# Altium project Analog.PrjPcb
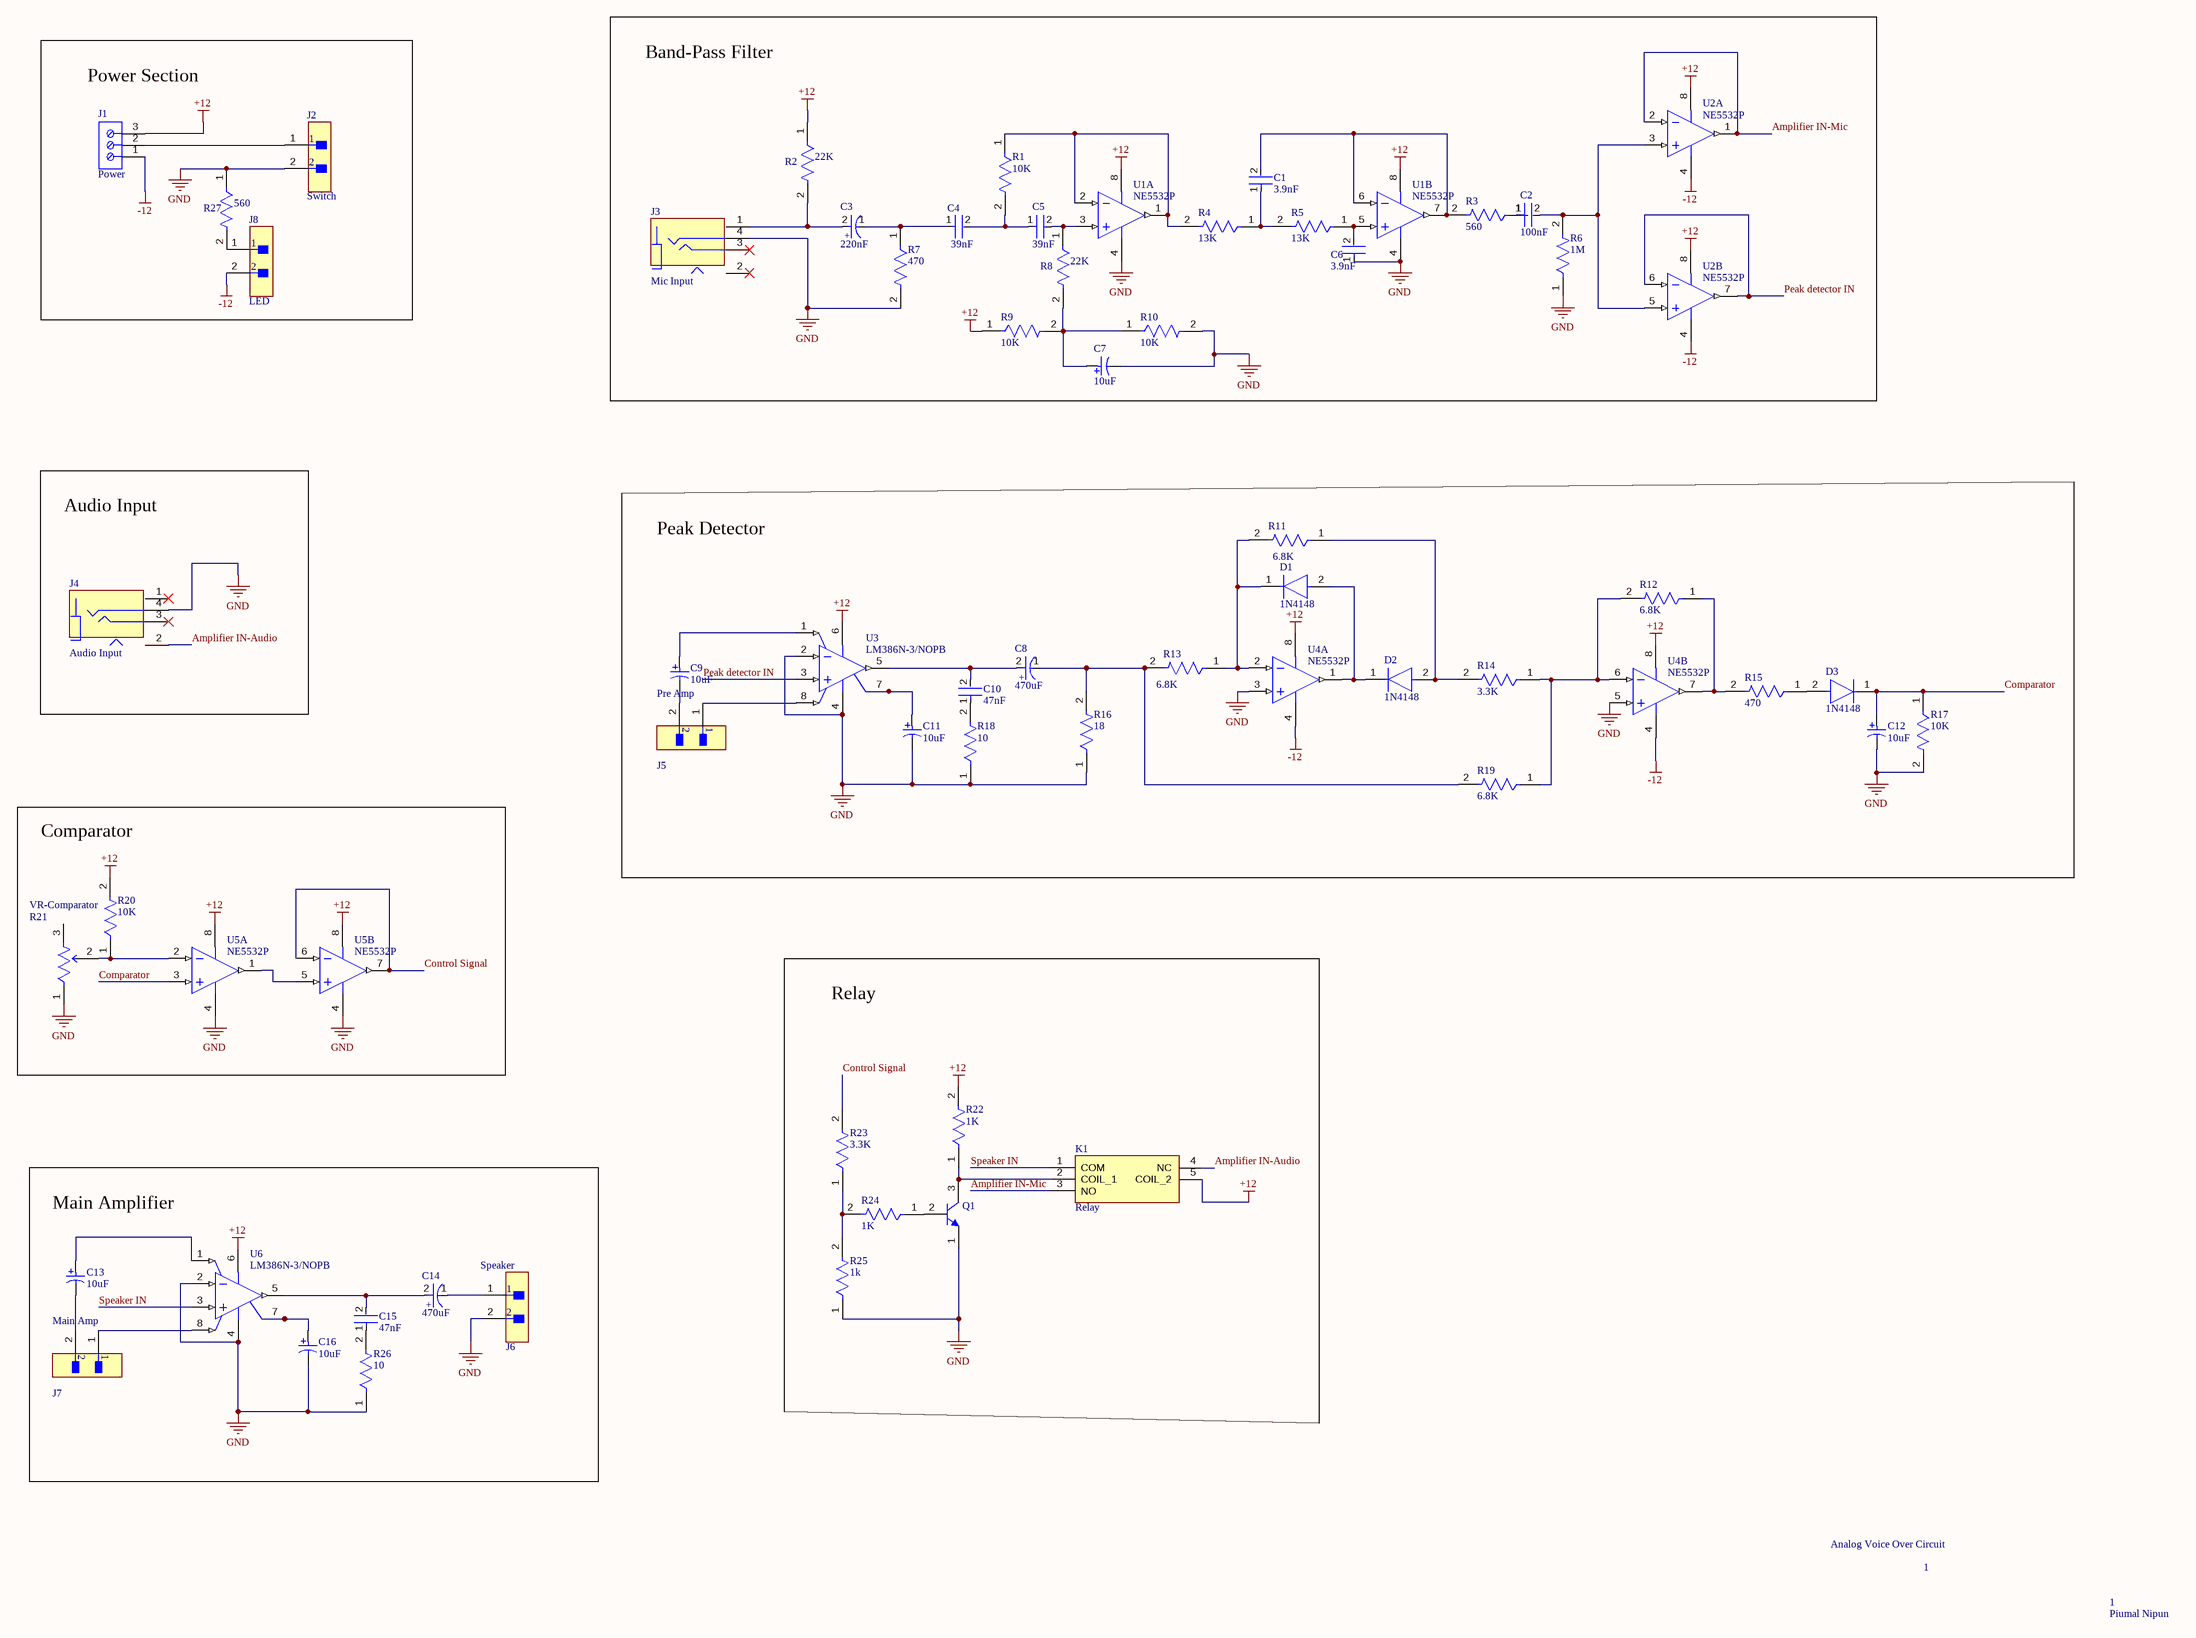
[diagram p0: Analog.SchDoc]
1 sheet, 62 parts. Net scope: global (net labels, ports and power ports of the same name join across sheets).
Board file: Analog.PcbDoc

## Sheet Analog.SchDoc
size C; ENG_APP_DATE: --/--/--; DSN_APP_DATE: --/--/--; CHK_APP_DATE: --/--/--; SheetNumber: 1; SheetTotal: 1

### Parts
C1  3.9nF  [FP-RCE0DB-MFG]
C2  100nF  [FP-RCE0DB-MFG]
C3  220nF  [FP-RAD-TH-D_8_0_5-L_11_5-MFG]
C4  39nF  [FP-RCE0DB-MFG]
C5  39nF  [FP-RCE0DB-MFG]
C6  3.9nF  [FP-RCE0DB-MFG]
C7  10uF  [CAPPR55-200-1100X500X1200]
C8  470uF  [FP-RAD-TH-D_8_0_5-L_11_5-MFG]
C9  10uF  [CAPPR55-200-1100X500X1200]
C10  47nF  [FP-RCE0DB-MFG]
C11  10uF  [CAPPR55-200-1100X500X1200]
C12  10uF  [CAPPR55-200-1100X500X1200]
C13  10uF  [CAPPR55-200-1100X500X1200]
C14  470uF  [FP-RAD-TH-D_8_0_5-L_11_5-MFG]
C15  47nF  [FP-RCE0DB-MFG]
C16  10uF  [CAPPR55-200-1100X500X1200]
D1  1N4148  [FP-017AG-MFG]
D2  1N4148  [FP-017AG-MFG]
D3  1N4148  [FP-017AG-MFG]
J1  Power  [691101710003]
J2  Switch  [FP-B2B-XH-A_LF_SN-MFG]
J3  Mic Input  [CUI_SJ2-3574A-SMT-TR]
J4  Audio Input  [CUI_SJ2-3574A-SMT-TR]
J5  Pre Amp  [FP-B2B-XH-A_LF_SN-MFG]
J6  Speaker  [FP-B2B-XH-A_LF_SN-MFG]
J7  Main Amp  [FP-B2B-XH-A_LF_SN-MFG]
J8  LED  [FP-B2B-XH-A_LF_SN-MFG]
K1  Relay  [AZ9431CH12DE]
Q1  (no value)  [FAIR-TO-92]
R1  10K  [FP-CF18-MFG]
R2  22K  [FP-CF18-MFG]
R3  560  [FP-CF18-MFG]
R4  13K  [FP-CF18-MFG]
R5  13K  [FP-CF18-MFG]
R6  1M  [FP-CF18-MFG]
R7  470  [FP-CF18-MFG]
R8  22K  [FP-CF18-MFG]
R9  10K  [FP-CF18-MFG]
R10  10K  [FP-CF18-MFG]
R11  6.8K  [FP-CF18-MFG]
R12  6.8K  [FP-CF18-MFG]
R13  6.8K  [FP-CF18-MFG]
R14  3.3K  [FP-CF18-MFG]
R15  470  [FP-CF18-MFG]
R16  18  [FP-CF18-MFG]
R17  10K  [FP-CF18-MFG]
R18  10  [FP-CF18-MFG]
R19  6.8K  [FP-CF18-MFG]
R20  10K  [FP-CF18-MFG]
R21  VR-Comparator  [FP-3296W-MFG]
R22  1K  [FP-CF18-MFG]
R23  3.3K  [FP-CF18-MFG]
R24  1K  [FP-CF18-MFG]
R25  1k  [FP-CF18-MFG]
R26  10  [FP-CF18-MFG]
R27  560  [FP-CF18-MFG]
U1  NE5532P  [P0008A]  (parts A,B of 2)
U2  NE5532P  [P0008A]  (parts A,B of 2)
U3  LM386N-3/NOPB  [TI-P8]
U4  NE5532P  [P0008A]  (parts A,B of 2)
U5  NE5532P  [P0008A]  (parts A,B of 2)
U6  LM386N-3/NOPB  [TI-P8]

### Blocks framed on the sheet
Power Section: J1 J2 J8 R27
Band-Pass Filter: C1-C7 J3 R1-R10 U1 U2
Audio Input: J4
Peak Detector: C8-C12 D1-D3 J5 R11-R19 U3 U4
Comparator: R20 R21 U5
Relay: K1 Q1 R22-R25
Main Amplifier: C13-C16 J6 J7 R26 U6

### Nets
+12: J1.3 K1.5(COIL_2) R2.1 R9.1 R20.2 R22.2 U1.8(VCC+) U2.8(VCC+) U3.6(VS) U4.8(VCC+) U5.8(VCC+) U6.6(VS)
-12: J1.1 J8.2 U2.4(VCC-) U4.4(VCC-)
GND: C6.1 C7.2 C11.2 C12.2 C16.2 J2.2 J3.4 J4.4 J6.2 Q1.1(E) R6.1 R7.2 R10.2 R16.1 R17.2 R18.1 R21.1(CCW) R25.1 R26.1 R27.1 U1.4(VCC-) U3.2(IN-) U3.4(GND) U4.3(IN1+) U4.5(IN2+) U5.4(VCC-) U6.2(IN-) U6.4(GND)
Amplifier IN-Audio: J4.2 K1.4(NC)
Amplifier IN-Mic: K1.3(NO) U2.1(OUT1) U2.2(IN1-)
Comparator: C12.1 D3.1(C) R17.1 U5.3(IN1+)
Control Signal: R23.2 U5.6(IN2-) U5.7(OUT2)
Peak detector IN: U2.6(IN2-) U2.7(OUT2) U3.3(IN+)
Speaker IN: K1.1(COM) U6.3(IN+)
NetC1_1: C1.1 R4.1 R5.2
NetC1_2: C1.2 R3.2 U1.6(IN2-) U1.7(OUT2)
NetC2_1: C2.1 R3.1
NetC2_2: C2.2 R6.2 U2.3(IN1+) U2.5(IN2+)
NetC3_1: C3.1(C) C4.1 R7.1
NetC3_2: C3.2(A) J3.1 R2.2
NetC4_2: C4.2 C5.1 R1.2
NetC5_2: C5.2 R8.1 U1.3(IN1+)
NetC6_2: C6.2 R5.1 U1.5(IN2+)
NetC7_1: C7.1 R8.2 R9.2 R10.1
NetC8_1: C8.1(C) R13.2 R16.2 R19.2
NetC8_2: C8.2(A) C10.2 U3.5(VOUT)
NetC9_1: C9.1 U3.1(GAIN)
NetC9_2: C9.2 J5.2
NetC10_1: C10.1 R18.2
NetC11_1: C11.1 U3.7(BYPASS)
NetC13_1: C13.1 U6.1(GAIN)
NetC13_2: C13.2 J7.2
NetC14_1: C14.1(C) J6.1
NetC14_2: C14.2(A) C15.2 U6.5(VOUT)
NetC15_1: C15.1 R26.2
NetC16_1: C16.1 U6.7(BYPASS)
NetD1_1: D1.1(C) R11.2 R13.1 U4.2(IN1-)
NetD1_2: D1.2(A) D2.1(C) U4.1(OUT1)
NetD2_2: D2.2(A) R11.1 R14.2
NetD3_2: D3.2(A) R15.1
NetJ1_2: J1.2 J2.1
NetJ5_1: J5.1 U3.8(GAIN)
NetJ7_1: J7.1 U6.8(GAIN)
NetJ8_1: J8.1 R27.2
NetK1_2: K1.2(COIL_1) Q1.3(C) R22.1
NetQ1_2: Q1.2(B) R24.1
NetR1_1: R1.1 R4.2 U1.1(OUT1) U1.2(IN1-)
NetR12_1: R12.1 R15.2 U4.7(OUT2)
NetR12_2: R12.2 R14.1 R19.1 U4.6(IN2-)
NetR20_1: R20.1 R21.2(WIPER) U5.2(IN1-)
NetR23_1: R23.1 R24.2 R25.2
NetU5_1: U5.1(OUT1) U5.5(IN2+)

Not connected (* = marked no-connect by the designer): J3 2* 3*; J4 1* 3*; R21 3(CW)

### Notes on the sheet
- Analog Voice Over Circuit
- 1
- Piumal Nipun
- DWG. NO.
- REV.
- SHT.
- REVISION
- DESCRIPTION
- DATE
- APPROVED
- THIS DOCUMENT AND THE DATA DISCLOSED HEREIN OR HEREWITH IS THE PROPERTY OF ALTIUM LIMITED AND MAY BE FREELY DISTRIBUTED IN WHOLE. NO RIGHTS ARE RESERVED OR EXPRESS OR IMPLIED WARANTEE GIVEN.
- ENG:
- DSN:
- APPROVALS
- PROJECT
- DOCUMENT REVISION:
- DESIGN ITEM:
- CHK:
- BOM:
- REFERENCE DOCUMENTS
- PROJECT REVISION:
- TITLE
- FAB DWG:
- PCB DWG:
- ASSY DWG:
- SCALE:
- SIZE
- C
- CAGE CODE
- FILE NAME
- DWG NO.
- SHEET
- OF
- REV
- (in symbol CMP-05427-001287-1) +

### Library data of the parts
C1 C2 C4-C6 C10 C15 = CMP-06035-047347-1: Cap Ceramic 22pF 100V C0G ±5% Radial 2.5mm +125°C Ammo Pack; Lead Diameter: 0.5mm; Lead/Base Style: Straight; Height: 3.5mm; Voltage: 100V; Mount: Through Hole; Min Operating Temperature: -55°C; Height - Seated (Max): 0.138inch; Dielectric: C0G; Width: 0.098inch; Depth: 2.5mm; Lead Pitch: 0.098inch; Packaging: Tape and Reel; Voltage Rating (DC): 100V; Capacitance: 22pF; Package Quantity: 2000; Max Operating Temperature: 125°C; Tolerance: 5%; Termination: Radial; Voltage Rating: 100V; Case/Package: Radial; Resistor Type: Ceramic; Length: 3.6mm; Ratings: AEC-Q200
C3 C8 C14 = CMP-05427-001287-1: Aluminum Electrolytic Capacitors (Radial Lead Type) 470uF ±20% 16V; Life (Hours): 6000Hour; Lead Diameter: 0.6mm; Ripple Current: 950mA; Impedance: 56mR; Voltage Rating: 16V; Features: General Purpose; Capacitance: 470uF; Max Operating Temperature: 105°C; RoHS Compliant: Yes; Mount: Through Hole; Termination: Radial; Voltage Rating (DC): 16V; Series: FR; Case/Package: Radial; Radiation Hardening: No; Diameter: 8mm; Lead Free: Lead Free; Height - Seated (Max): 0.512inch; Lead Pitch: 5mm; Tolerance: 20%; Height: 11.5mm; ESR (Equivalent Series Resistance): 56mR; Packaging: Ammo Pack; Length: 11.5mm; Package Quantity: 1; Min Operating Temperature: -40°C; REACH SVHC: No SVHC
C7 C9 C11-C13 C16 = CMP-1665-00038-2: Aluminum Electrolytic Capacitor, 10 uF, +/- 20%, 50 V, -40 to 85 degC, 2-Pin THD, RoHS, Bulk; Manufacturer: Panasonic; Life (Hours): 2000Hour; Lead/Base Style: Straight; Dissipation Factor: 0.12%; Leakage Current: 3uA; Dielectric Material: Aluminium; Lead Diameter: 0.5mm; Voltage Rating: 50V; Ripple Current: 65mA; Package Reference: CAPPR55-200-1100X500X1200; Height: 11mm; Diameter: 5mm; REACH SVHC: NoSVHC; Mount: ThroughHole; Packaging: Bulk; Manufacturer URL: http://www.panasonic.com/; Capacitance: 10uF; Termination: Radial; Datasheet URL: https://industrial.panasonic.com/cdbs/www-data/pdf/RDF0000/ABA0000C1218.pdf; Lead Free: LeadFree; Height - Seated (Max): 0.472inch; Case/Package: Radial; Package Description: 2-Pin Radial Lead, Dia 5 mm, Height 12 mm; Tolerance: 20%; Datasheet Version: Rev. 05, 10/2016; Package Quantity: 200; Ripple Current (AC): 65mA; Min Operating Temperature: -40degC; RoHSCompliant: true; Number of Pins: 2; Max Operating Temperature: 85degC; Voltage: 50V; Lead Pitch: 2mm; Radiation Hardening: No; Voltage Rating (DC): 50V; Length: 11mm
D1-D3 = CMP-07163-000046-1: DIODE GEN PURP 100V 200MA DO35; Forward Voltage: 1V; Max Power Dissipation: 500mW; Max Reverse Current: 5uA; Forward Current: 300mA; Current: 4A; Reverse Recovery Time: 4ns; Element Configuration: Single; Outside Diameter: 1.85mm; Capacitance: 4pF; Polarity: Standard; Max Forward Surge Current (Ifsm): 1A; Reverse Voltage: 100V; Output Current: 200mA; Average Rectified Current: 200mA; Diameter: 1.91mm; Max Repetitive Reverse Voltage (Vrrm): 100V; Current Rating: 200mA; Case/Package: DO-35; Lead Free: Lead Free; Number of Pins: 2; Recovery Time: 4ns; Packaging: Bulk; Contact Plating: Tin; Voltage: 100V; Mount: Through Hole; Max Surge Current: 4A; Package Quantity: 2000; Width: 1.91mm; Max Reverse Voltage (DC): 100V; Length: 4.56mm; Radiation Hardening: No; Power Dissipation: 500mW; Voltage Rating (DC): 100V; Peak Non-Repetitive Surge Current: 4A; REACH SVHC: No SVHC; Height: 4.56mm; Max Operating Temperature: 175°C; Series: -; Weight: 0.01lb; Min Operating Temperature: -65°C
J1 = CMP-1502-03257-2: NexarPartId: 8917705; Voltage Rating: 250V; Current: 16A; Wire Gauge (Min): 14AWG; Pitch: 5.0038mm; Wire Gauge (Max): 26AWG; Number of Positions Per Level: 3; Plating: Steel; Number of Levels: 1; Stripping Length: -7mm; REACH SVHC: Unknown; Width: 16.2mm; Height: 16.4mm; Contact Material: Brass; RoHS: Compliant; Color: Blue; Contact Plating: Tin; Lead Pitch: 5mm; Packaging: Box; Termination: Screw; Number of Contacts: 3; Wire/Cable Gauge: 26AWG; Min Operating Temperature: -40°C; Max Operating Temperature: 105°C; Housing Material: Nylon; Length: 9mm; Voltage: 250V; Mount: Through Hole; Current Rating: 16A; Number of Pins: 3
J2 J5-J8 = CMP-2000-05888-3: CONN HEADER VERT 2POS 2.5MM; Current Rating: 3A; Voltage Rating: 250V; Number of Contacts: 2; Contact Resistance: 20mR; Wire/Cable Gauge: 22AWG; Insulation Resistance: 1GR; Connector Type: Male Pin; Packaging: Bulk; Contact Material: Brass; Lead Free: Lead Free; Orientation: Straight; Contact Plating: Tin; Max Current Rating: 3A; Termination: Solder; Fastening Type: Detent; Depth: 5.75mm; Housing Material: Polyamide; REACH SVHC: No SVHC; Series: XH; Voltage Rating (AC): 250V; Number of Positions: 2; Color: Natural; Contact Type: Male Pin; Max Voltage Rating (DC): 250V; Pitch: 2.5mm; Lead Pitch: 2.5mm; Mount: Through Hole; Max Operating Temperature: 85°C; Length: 7.4mm; Max Voltage Rating (AC): 250V; Min Operating Temperature: -25°C; Number of Rows: 1; Housing Color: White
J3 J4 = SJ2-3574A-SMT-TR: 3.5 mm, Stereo, Right Angle, Surface Mount (SMT), Audio Jack Connector; MF: CUI Devices; SnapEDA_Link: https://www.snapeda.com/parts/SJ2-3574A-SMT-TR/CUI+Devices/view-part/?ref=snap; Package: None; MP: SJ2-3574A-SMT-TR; CUI_purchase_URL: https://www.cuidevices.com/product/interconnect/connectors/audio-connectors/jacks/sj2-357x-smt-series?utm_source=snapeda.com&utm_medium=referral&utm_campaign=snapedaBOM; Check_prices: https://www.snapeda.com/parts/SJ2-3574A-SMT-TR/CUI+Devices/view-part/?ref=eda; Purchase-URL: https://pricing.snapeda.com/search/part/SJ2-3574A-SMT-TR/?ref=eda; Price: None; Value: *; Availability: In Stock
K1 = AZ943-1CH-12DE: Relay or Contactor; Manufacturer_Name: Zettler Group; Datasheet Link: http://www.azettler.com/pdfs/az943.pdf; Height: 15.95mm; Manufacturer_Part_Number: AZ943-1CH-12DE
Q1 = CMP-2000-04944-1: NPN General-Purpose Amplifier, 40 V VCEO, 0.2 A, -55 to 150 degC, 2-Pin TO-92, RoHS, Bulk; Manufacturer: FairchildSemiconductor; Maximum Collector Base Voltage: 60V; Minimum DC Current Gain: 40@0.1mA@1V; Maximum Collector Emitter Voltage: 40V; Maximum DC Collector Current: 0.2A; Rad Hard: No; Maximum Operating Frequency: 300(Min)MHz; Maximum Collector Emitter Saturation Voltage: 0.2@1mA@10mA; Maximum Power Dissipation: 625mW; Package Description: 3-Pin Transistor Outline Package, Body Dia 4.79 mm, Pitch 1.27 mm; Package Reference: TO-92; Pin Count: 3; Operating Temperature: -55to150degC; Category: GPBJT; Manufacturer URL: https://www.fairchildsemi.com/; Datasheet URL: https://datasheet.ciiva.com/4722/2n3904-82270-4722369.pdf; Package: 3TO-92; Packaging: Bulk; Type: NPN; Datasheet Version: Rev. 1.1.0, 10/2014; Mounting: ThroughHole
R1-R20 R22-R27 = CMP-26528-000002-1: RES 10K OHM 1/8W 5% CF AXIAL; Manufacturer Part Number: CF18JT10K0; Manufacturer: Stackpole Electronics; Power Rating: 0.125W; Temperature Coefficient: 0-500ppm/°C; Resistance: 10kΩ; Voltage Rating: 250V; Value: 10kΩ; Temperature: -55°C to +155°C; Height: 2mm; Lead Free: Yes; Automotive: No; Device Class L2: Resistors; Package: CF18; Series: CF; ComponentLink2Description: Datasheet; Ipc Land Pattern Name: RESAD656W65L360D200; Temperature Range High: +155°C; RoHS: TRUE; Device Class L3: Through-Hole Resistors; Temperature Range Low: -55°C; Device Class L1: Passive Components; Category: Res; Octopart: https://octopart.com/cf18jt10k0-stackpole+electronics-19205642; Composition: Carbon Film; Digikey Description: RES 10K OHM 1/8W 5% CF AXIAL; ComponentLink2URL: http://www.seielect.com/Catalog/SEI-CF_CFM.pdf; Tolerance: 5%
R21 = CMP-1747-00001-8: TRIMMER 10K OHM 0.5W PC PIN TOP; Number of Turns: 25; Tolerance: 10%; Resistance: 10kR; Max Power Dissipation: 500mW; Temperature Coefficient: 100ppm/°C; Insulation Resistance: 1GR; Min Operating Temperature: -55°C; Resistor Type: Cermet; Series: 3296; Color: Blue; Mount: Through Hole; Taper: Linear; Radiation Hardening: No; RoHS Compliant: Yes; Width: 9.53mm; Resistance Tolerance: 10%; Contact Plating: Tin; Military Standard: Not; Package Quantity: 50; Weight: 0.03oz; Lead Free: Lead Free; Power Rating: 500mW; Termination: Pin; Technology: CERMET; Max Operating Temperature: 125°C; Packaging: Rail/Tube; Length: 9.53mm; Depth: 4.83mm; Height: 11.55mm; Reach SVHC Compliant: Yes
U1 U2 U4 U5 = CMP-0017-00910-2: Dual Low-Noise High-Speed Audio Operational Amplifier, 10 to 30 V, 0 to 70 degC, 8-pin DIP (P8), Pb-Free (RoHS); Manufacturer: Texas Instruments; Iq per channel(Max)(mA): 4; Slew Rate(Typ)(V/us): 9; Vn at 1kHz(Typ)(nV/rtHz): 5; IIB(Max)(pA): 800000; Total Supply Voltage(Max)(+5V is 5, +/-5V is 10): 30; GBW(Typ)(MHz): 10; CMRR(Min)(dB): 70; Number of Channels: 2; Sub Family: General Purpose Amplifier, High Supply Voltage Amplifier (>=30V), Low Noise Amp (<=10nV/rtHz); ComponentLink2URL: http://www.ti.com/lit/ds/symlink/ne5532.pdf; PackageReference: P0008A; PackageDescription: 8-Pin Plastic In-Line, Body 9.59 x 6.35 mm, Pitch 2.54 mm; ComponentLink1Description: Manufacturer URL; Eco-Plan: Pb-Free (RoHS); Mounting Technology: Through Hole; Code_JEDEC: MS-001; PackageVersion: 4040082/E, 04/2010; DatasheetVersion: SLOS075I; ComponentLink3URL: http://www.ti.com/litv/pdf/mpdi001b; ComponentLink2Description: Datasheet; Vio (25C)(Max)(mV): 4; PartNumber: NE5532P; ComponentLink3Description: Package Specification; Total Supply Voltage(Min)(+5V is 5, +/-5V is 10): 10; ComponentLink1URL: http://www.ti.com/
U3 U6 = CMP-0994-00138-1: Low Voltage Audio Power Amplifier, 0 to 70 degC, 8-pin DIP (P8), Green (RoHS & no Sb/Br); Manufacturer: Texas Instruments; Input Type: Analog; SubFamily: Mid/High-Power Amplifier; Max. Number of Speaker Outputs: 1; ComponentLink3Description: Package Specification; DatasheetVersion: SNAS545A; Mounting Technology: Through Hole; ComponentLink3URL: http://www.ti.com/litv/pdf/mpdi001b; PackageVersion: 4040082/E, 04/2010; PartNumber: LM386N-3/NOPB; ComponentLink1Description: Manufacturer URL; PackageDescription: 8-Pin Plastic In-Line, Body 9.59 x 6.35 mm, Pitch 2.54 mm; Eco-Plan: Green (RoHS & no Sb/Br); ComponentLink2URL: http://www.ti.com/general/docs/lit/getliterature.tsp?genericPartNumber=LM386&fileType=pdf; Code_JEDEC: MS-001; ComponentLink1URL: http://www.ti.com/; ComponentLink2Description: Datasheet; PackageReference: P8